# EAGLE design LiPo_Charger_UPDI_Adapter (EAGLE 7.7.0)
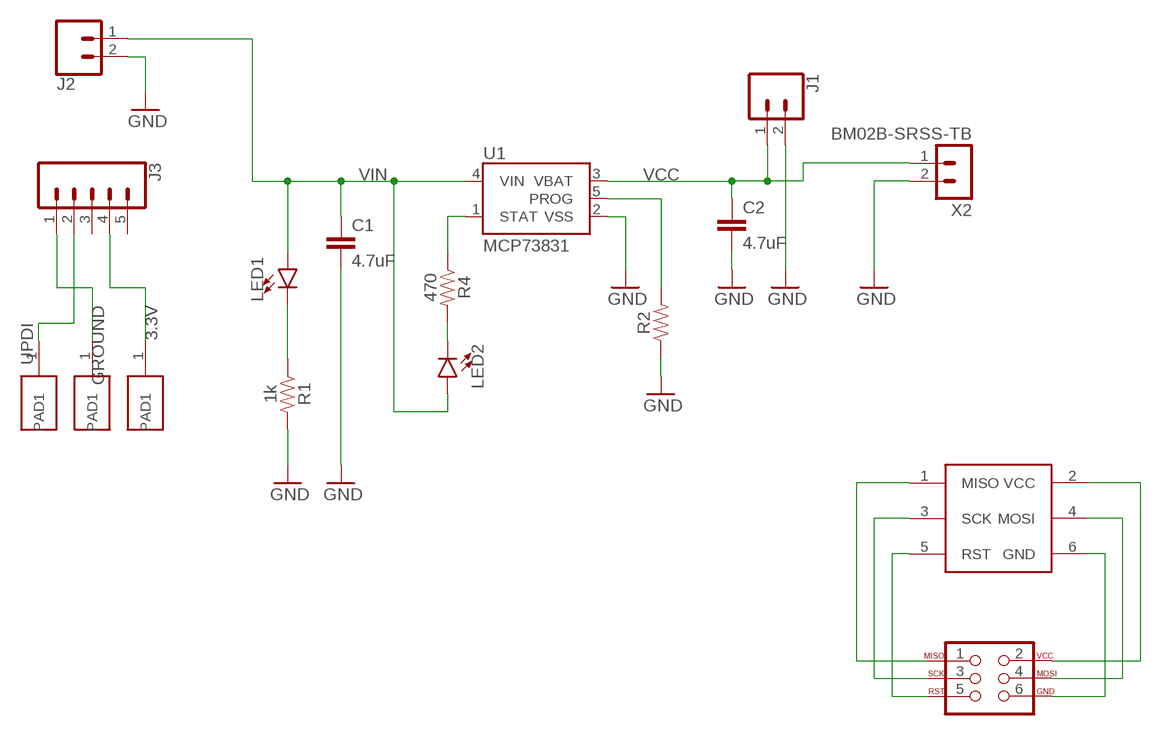
[diagram p0: schematic, sheet 1]

## Parts
C1  4.7uF  4.7UF-1206-16V-(+80/-20%)  [1206]
C2  4.7uF  4.7UF-1206-16V-(+80/-20%)  [1206]
J1  CONN_02  [1X02]
J2  CONN_02  [1X02]
J3  CONN_05  [1X05]
J4  AVR_SPI_PROG_3X2NS  [2X3-NS]
LED1  LED-FKIT-1206  [FKIT-LED-1206]
LED2  LED-FKIT-1206  [FKIT-LED-1206]
R1  1k  RESISTOR1206  [1206]
R2  RESISTORAXIAL-0.3  [AXIAL-0.3]
R4  470  RESISTOR1206  [1206]
U1  MCP73831  [SOT23-5]
U$1  SINGLE_1.27MM_HOLE  [1.27MM_SINGLE_HOLE]
U$2  SINGLE_1.27MM_HOLE  [1.27MM_SINGLE_HOLE]
U$3  SINGLE_1.27MM_HOLE  [1.27MM_SINGLE_HOLE]
U$4  2X3_1.27MM_ICSP  [2X3_1.27MM_ICSP]
X2  BM02B-SRSS-TB  [BM02B-SRSS-TB]

## Nets
3.3V: J3.4 U$3.1(PAD1)
GND: C1.2 C2.2 J1.2 J2.2 R1.2 R2.P$1 U1.2(VSS) X2.2
GROUND: J3.1 U$2.1(PAD1)
N$1: LED1.C R1.1
N$2: LED2.C R4.2
N$3: J4.1 U$4.1(MISO)
N$4: J4.3 U$4.3(SCK)
N$5: J4.5 U$4.5(RST)
N$6: J4.6 U$4.6(GND)
N$7: J4.4 U$4.4(MOSI)
N$8: J4.2 U$4.2(VCC)
PROG: R2.P$2 U1.5(PROG)
STAT: R4.1 U1.1(STAT)
UPDI: J3.2 U$1.1(PAD1)
VCC: C2.1 J1.1 U1.3(VBAT) X2.1
VIN: C1.1 J2.1 LED1.A LED2.A U1.4(VIN)
Unconnected: J3.3 J3.5

## Library data of the parts
C1 C2 = SparkFun-Capacitors:4.7UF: 4.7µF ceramic capacitors A capacitor is a passive two-terminal electrical component used to store electrical energy temporarily in an electric field.; PROD_ID: CAP-10300
J1 = MCXI_master_lib:CONN_02: Multi connection point. Often used as Generic Header-pin footprint for 0.1 inch spaced/style header connections On any of the 0.1 inch spaced packages, you can populate with these: Break Away Headers - Straight <https://www.sparkfun.com/products/116> (PRT-00116) Break Away Male Headers - Right Angle <https://www.sparkfun.com/products/553> (PRT-00553) Female Headers <https://www.sparkfun.com/products/115> (PRT-00115) Break Away Headers - Machine Pin <https://www.sparkfun.com/products/117> (PRT-00117) Break Away Female Headers - Swiss Machine Pin <https://www.sparkfun.com/products/743> (PRT-00743) For SCREWTERMINALS and SPRING TERMINALS visit here: Screw Terimnals on SparkFun.com <https://www.sparkfun.com/search/results?term=Screw+Terminals> (5mm/3.5mm/2.54mm spacing) This device is also useful as a general connection point to wire up your design to another part of your project. Our various solder wires solder well into these plated through hole pads. Hook-Up Wire - Assortment (Stranded, 22 AWG) <https://www.sparkfun.com/products/11375> (PRT-11375) Hook-Up Wire - Assortment (Solid Core, 22 AWG) <https://www.sparkfun.com/products/11367> (PRT-11367) View the entire wire category on our website here <https://www.sparkfun.com/categories/141> Special notes: Molex polarized connector foot print use with: PRT-08233 with associated crimp pins and housings. 2.54_SCREWTERM for use with PRT-10571. 3.5mm Screw Terminal footprints for PRT-08084 5mm Screw Terminal footprints for use with PRT-08432
J2 = SparkFun-Connectors:CONN_02: Multi connection point. Often used as Generic Header-pin footprint for 0.1 inch spaced/style header connections On any of the 0.1 inch spaced packages, you can populate with these: Break Away Headers - Straight <https://www.sparkfun.com/products/116> (PRT-00116) Break Away Male Headers - Right Angle <https://www.sparkfun.com/products/553> (PRT-00553) Female Headers <https://www.sparkfun.com/products/115> (PRT-00115) Break Away Headers - Machine Pin <https://www.sparkfun.com/products/117> (PRT-00117) Break Away Female Headers - Swiss Machine Pin <https://www.sparkfun.com/products/743> (PRT-00743) For SCREWTERMINALS and SPRING TERMINALS visit here: Screw Terimnals on SparkFun.com <https://www.sparkfun.com/search/results?term=Screw+Terminals> (5mm/3.5mm/2.54mm spacing) This device is also useful as a general connection point to wire up your design to another part of your project. Our various solder wires solder well into these plated through hole pads. Hook-Up Wire - Assortment (Stranded, 22 AWG) <https://www.sparkfun.com/products/11375> (PRT-11375) Hook-Up Wire - Assortment (Solid Core, 22 AWG) <https://www.sparkfun.com/products/11367> (PRT-11367) View the entire wire category on our website here <https://www.sparkfun.com/categories/141> Special notes: Molex polarized connector foot print use with: PRT-08233 with associated crimp pins and housings. 2.54_SCREWTERM for use with PRT-10571. 3.5mm Screw Terminal footprints for PRT-08084 5mm Screw Terminal footprints for use with PRT-08432
J3 = SparkFun-Connectors:CONN_05: Multi connection point. Often used as Generic Header-pin footprint for 0.1 inch spaced/style header connections On any of the 0.1 inch spaced packages, you can populate with these: Break Away Headers - Straight <https://www.sparkfun.com/products/116> (PRT-00116) Break Away Male Headers - Right Angle <https://www.sparkfun.com/products/553> (PRT-00553) Female Headers <https://www.sparkfun.com/products/115> (PRT-00115) Break Away Headers - Machine Pin <https://www.sparkfun.com/products/117> (PRT-00117) Break Away Female Headers - Swiss Machine Pin <https://www.sparkfun.com/products/743> (PRT-00743) For SCREWTERMINALS and SPRING TERMINALS visit here: Screw Terimnals on SparkFun.com <https://www.sparkfun.com/search/results?term=Screw+Terminals> (5mm/3.5mm/2.54mm spacing) This device is also useful as a general connection point to wire up your design to another part of your project. Our various solder wires solder well into these plated through hole pads. Hook-Up Wire - Assortment (Stranded, 22 AWG) <https://www.sparkfun.com/products/11375> (PRT-11375) Hook-Up Wire - Assortment (Solid Core, 22 AWG) <https://www.sparkfun.com/products/11367> (PRT-11367) View the entire wire category on our website here <https://www.sparkfun.com/categories/141> Special notes: Molex polarized connector foot print use with SKU : PRT-08231 with associated crimp pins and housings. 1MM SMD Version SKU: PRT-10208
J4 = MCXI_master_lib:AVR_SPI_PROG_3X2: AVR ISP 6 Pin This is the reduced ISP connector for AVR programming. Common on Arduino. This footprint will take up less PCB space and can be used with a 10-pin to 6-pin adapter such as SKU: BOB-08508 **Special note about "TEST_POINT" package. The stop mask is on the top side, so if you want your programming test points to be on the bottom of your board, make sure to place this package on the bottom side of the board. This also ensure that the orientation to program from the bottom side will be correct. SparkFun Products: SparkFun ISP Pogo Adapter <https://www.sparkfun.com/products/11591> - NS Tiny AVR Programmer <https://www.sparkfun.com/products/11801> -PTH
LED1 LED2 = SparkFun-LED:LED: LED (Generic) Standard schematic elements and footprints for 5mm, 3mm, 1206, and 0603 sized LEDs. Generic LEDs with no color specified.
R1 R2 R4 = SparkFun-Resistors:RESISTOR: Generic Resistor Package
U1 = SparkFun-PowerIC:MCP73831: Miniature single cell, fully integrated Li-Ion, Li-polymer charge management controller http://ww1.microchip.com/downloads/en/DeviceDoc/21984a.pdf IC-09995; PROD_ID: IC-09995
U$1-U$3 = MCXI_master_lib:SINGLE_1.27MM_HOLE
U$4 = MCXI_master_lib:2X3_1.27MM_ICSP
X2 = con-JST SH:BM02B-SRSS: JST SH series header 1.00mm pitch disconnectable crimp style connectors, vertical (side entry type), 2 pins

## Board
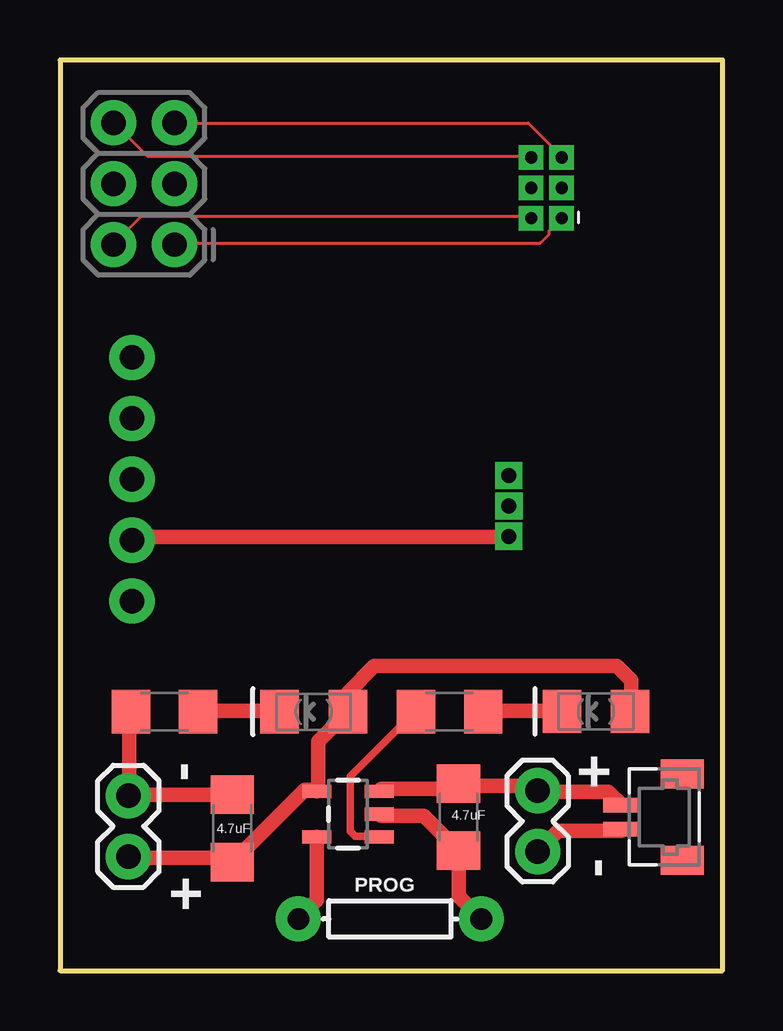
[diagram p1: board, top side]
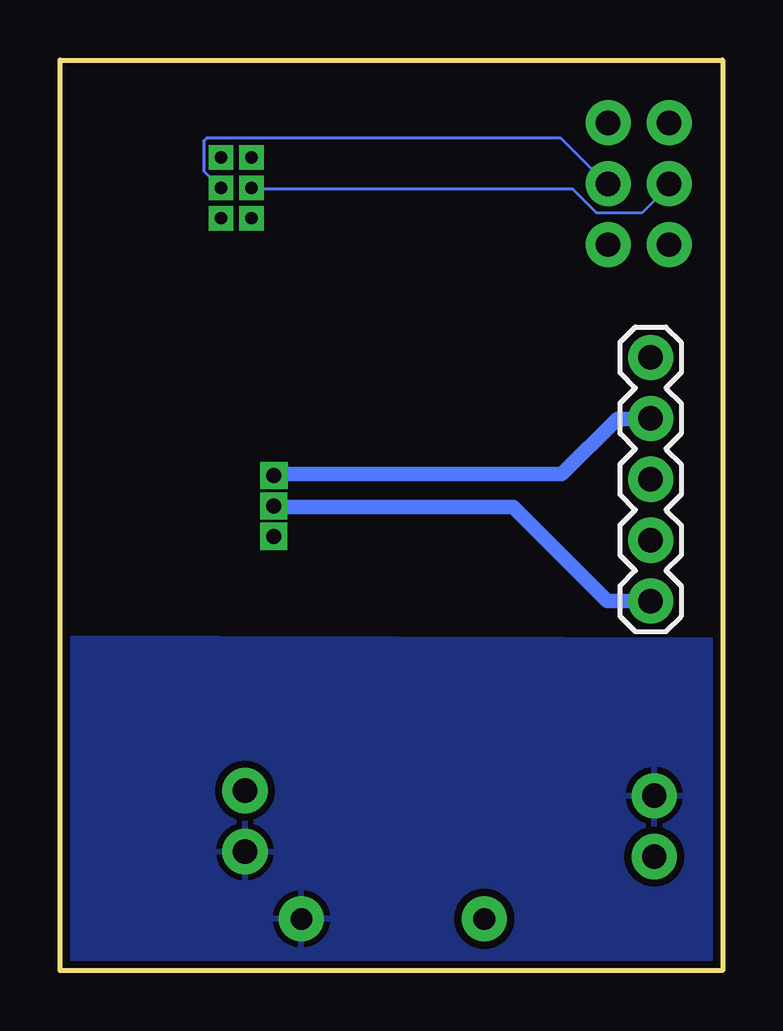
[diagram p2: board, bottom side, seen from below]

Size 27.61 x 37.96 mm. Coordinates in mm from the lower left corner, seen from the top.
Outline: 27.61,0 27.61,37.96 0,37.96 0,0 27.61,0
Copper layers (1*16): Top 0.035mm / dielectric 1.6mm / Bottom 0.035mm
Design rules "jlcpcb-2layers": minimum track width 5mil, minimum drill 0.3mm, track to track 5mil, track to pad 5mil, pad to pad 5mil, via to via 5mil, smd to smd 5mil, copper to edge 0.2mm, drill to drill 6mil, minimum pad ring 10mil, minimum via ring 3mil, stop-mask expansion 4mil, vias tented up to drill 0mil, thermal gap 10mil

### Footprints (pad centres in the part's own frame; a part is rotated, then mirrored left to right if it is on the bottom)
1206 = smd 1.6 x 1.8: 1 -1.4,0; 2 1.4,0
1X02 = drill 1.016 pad 1.88: 1 0,0; 2 2.54,0
1X05 = drill 1.016 pad 1.88: 1 0,0; 2 2.54,0; 3 5.08,0; 4 7.62,0; 5 10.16,0
2X3-NS = drill 1.016 pad 1.88: 1 -2.54,-1.27; 2 -2.54,1.27; 3 0,-1.27; 4 0,1.27; 5 2.54,-1.27; 6 2.54,1.27
FKIT-LED-1206 = smd 1.6 x 1.803: A -1.422,0; C 1.422,0
AXIAL-0.3 = drill 0.9 pad 1.88: P$1 -3.81,0; P$2 3.81,0
SOT23-5 = smd 0.55 x 1.2: 1 -0.95,-1.3; 2 0,-1.3; 3 0.95,-1.3; 4 0.95,1.3; 5 -0.95,1.3
1.27MM_SINGLE_HOLE = drill 0.63 pad 0.9 square: 1 0,0
2X3_1.27MM_ICSP = drill 0.508 pad 0.9 square: 1 0,2.54; 2 1.27,2.54; 3 0,1.27; 4 1.27,1.27; 5 0,0; 6 1.27,0
BM02B-SRSS-TB = smd 0.6 x 1.55: 1 0.5,0; 2 -0.5,0 | smd 1.2 x 1.8: M1 1.8,-2.525; M2 -1.8,-2.525

### Placement (x,y rotation side)
C1  7.17,5.93 90 top
C2  16.61,6.4 270 top
J1  19.9,7.5 270 top
J2  2.85,4.75 90 top
J3  3,15.4 90 bottom
J4  3.5,32.8 90 top
LED1  10.57,10.79 180 top
LED2  22.33,10.8 180 top
R1  4.35,10.79 180 top
R2  13.74,2.15 180 top
R4  16.23,10.79 0 top
U1  12,6.52 90 top
U$1  18.7,18.1 0 top
U$2  18.7,19.37 0 top
U$3  18.7,20.64 0 top
U$4  20.9,33.9 180 top
X2  23.4,6.4 90 top

### Tracks (layer width: path | path; a pad name or v marks a point on that pad's centre or on a via)
3.3V
  Bottom 0.127: 18.62,20.7 U$3.1 | 3,22.95 J3.4
  Bottom 0.61: 18.62,20.7 6.7,20.7 4.4,23 3.02,23 J3.4
GND
  Top 0.127: 13.38,6.45 U1.2 | 16.5,5.08 C2.2 16.62,5.08 | 23.38,5.83 X2.2 | 20,5.08 J1.2 19.88,5.08 | 2.88,10.7 R1.2 | 7.12,7.33 C1.2 | 2.88,7.33 J2.2
  Top 0.61: C1.2 2.88,7.33 2.88,10.72 R1.2 | 23.38,5.83 20.77,5.83 J1.2 | R2.P$1 16.61,3.1 C2.2 15.16,6.45 13.38,6.45
  pour Bottom (isolate 0.305): -0.8,-0.6 -0.6,13.76 35.31,13.86 35.61,-0.6
GROUND
  Bottom 0.127: 18.62,19.32 U$2.1 | 3,15.45 J3.1
  Bottom 0.61: 18.62,19.32 8.72,19.32 4.8,15.4 J3.1 2.5,15.4
N$1
  Top 0.127: 5.88,10.82 R1.1 | 9.12,10.82 LED1.C
  Top 0.61: 5.88,10.82 9.12,10.82 LED1.C
N$2
  Top 0.127: 17.75,10.82 R4.2 | 20.88,10.82 LED2.C
  Top 0.61: 17.75,10.82 20.89,10.82 LED2.C
N$3
  Top 0.127: U$4.1 20.88,31.32 20.38,30.82 20.38,30.7 20,30.32 4.88,30.32 J4.1
N$4
  Bottom 0.127: U$4.3 21,32.7 21.62,33.33 21.62,34.58 21.5,34.7 6.75,34.7 4.88,32.83 J4.3
N$5
  Top 0.127: U$4.5 20.88,33.95 19.5,35.33 4.88,35.33 J4.5
N$6
  Top 0.127: U$4.6 19.62,33.95 3.62,33.95 2.25,35.33 J4.6
N$7
  Bottom 0.127: U$4.4 19.62,32.58 6.25,32.58 5.25,31.57 3.38,31.57 2.25,32.7 J4.4
N$8
  Top 0.127: U$4.2 19.62,31.45 3.38,31.45 2.25,30.32 J4.2
PROG
  Top 0.61: U1.5 10.7,2.92 R2.P$2
STAT
  Top 0.127: 13,5.58 13.25,5.58 U1.1 | 14.75,10.7 R4.1
  Top 0.305: 14.75,10.7 14.7,10.7 12.1,8.1 12.1,5.8 12.3,5.6 13.28,5.6 U1.1
UPDI
  Top 0.127: 3.12,18.07 J3.2 | 18.62,18.07 U$1.1
  Top 0.61: 3.12,18.07 18.68,18.07 U$1.1
VCC
  Top 0.127: 16.38,7.58 16.5,7.7 C2.1 16.62,7.7 | 13.38,7.58 U1.3 | 23.38,6.95 X2.1 | 20,7.45 J1.1 19.88,7.58 19.75,7.7
  Top 0.61: 16.62,7.7 19.7,7.7 J1.1 | 20,7.45 22.85,7.45 X2.1 | 13.38,7.58 16.38,7.58 C2.1
VIN
  Top 0.127: 10.75,7.58 U1.4 | 11.88,10.7 LED1.A 12,10.82 | 23.75,10.82 LED2.A | 2.88,4.7 J2.1 | 7.38,4.7 7.25,4.58 C1.1 7.38,4.7
  Top 0.61: 2.88,4.7 7.01,4.7 C1.1 | 7.38,4.7 7.38,4.72 10.19,7.53 10.65,7.53 U1.4 | 10.75,7.58 10.75,9.55 LED1.A | 12,10.82 12,11.6 13.1,12.7 23.2,12.7 23.8,12.1 23.8,10.75 | 23.8,10.2 23.8,10.75 | 23.8,10.75 LED2.A

### Text on the board
tPlace: - | + | + | PROG | -